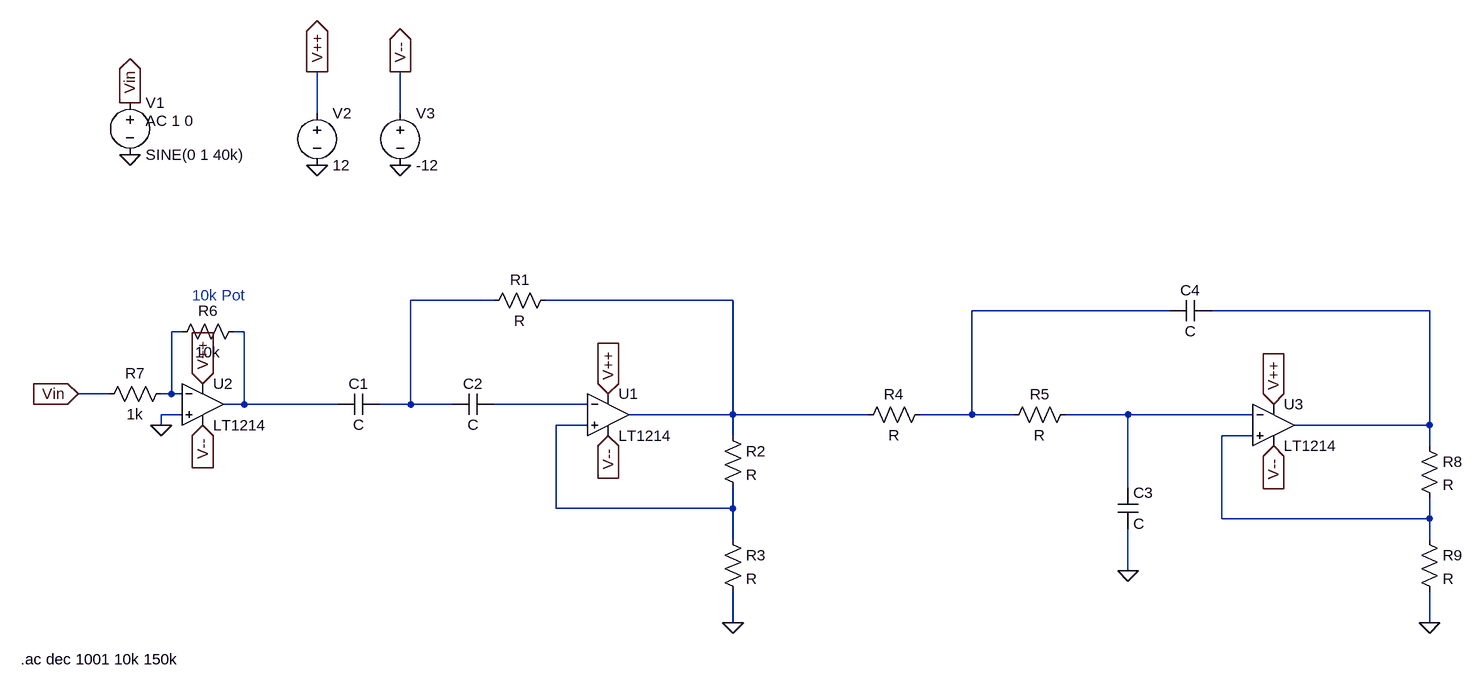
[diagram p0: schematic draftBandpassMultisimLive.asc]
draftBandpassMultisimLive.asc, the LTspice schematic file:
Version 4
SHEET 1 1752 680
WIRE -16 -320 -16 -384
WIRE 112 -320 112 -384
WIRE 256 -32 128 -32
WIRE 624 -32 336 -32
WIRE 1296 -16 992 -16
WIRE 1696 -16 1360 -16
WIRE -224 16 -240 16
WIRE -128 16 -144 16
WIRE -336 112 -384 112
WIRE -240 112 -240 16
WIRE -240 112 -256 112
WIRE -224 112 -240 112
WIRE -128 128 -128 16
WIRE -128 128 -160 128
WIRE 16 128 -128 128
WIRE 128 128 128 -32
WIRE 128 128 80 128
WIRE 192 128 128 128
WIRE 400 128 256 128
WIRE -224 144 -256 144
WIRE 624 144 624 -32
WIRE 624 144 464 144
WIRE 832 144 624 144
WIRE 992 144 992 -16
WIRE 992 144 912 144
WIRE 1056 144 992 144
WIRE 1232 144 1136 144
WIRE 1424 144 1232 144
WIRE -256 160 -256 144
WIRE 400 160 352 160
WIRE 1696 160 1696 -16
WIRE 1696 160 1488 160
WIRE 624 176 624 144
WIRE 1424 176 1376 176
WIRE 1696 192 1696 160
WIRE 1232 256 1232 144
WIRE 352 288 352 160
WIRE 624 288 624 256
WIRE 624 288 352 288
WIRE 1376 304 1376 176
WIRE 1696 304 1696 272
WIRE 1696 304 1376 304
WIRE 624 336 624 288
WIRE 1696 336 1696 304
WIRE 1232 384 1232 320
WIRE 624 464 624 416
WIRE 1696 464 1696 416
FLAG -16 -240 0
FLAG 112 -240 0
FLAG -16 -384 V++
IOPIN -16 -384 Out
FLAG 112 -384 V--
IOPIN 112 -384 Out
FLAG -304 -256 0
FLAG -304 -336 Vin
IOPIN -304 -336 Out
FLAG -256 160 0
FLAG -192 160 V--
IOPIN -192 160 In
FLAG -192 96 V++
IOPIN -192 96 In
FLAG -384 112 Vin
IOPIN -384 112 In
FLAG 432 176 V--
IOPIN 432 176 In
FLAG 432 112 V++
IOPIN 432 112 In
FLAG 624 464 0
FLAG 1232 384 0
FLAG 1456 192 V--
IOPIN 1456 192 In
FLAG 1456 128 V++
IOPIN 1456 128 In
FLAG 1696 464 0
SYMBOL voltage -16 -336 R0
WINDOW 123 0 0 Left 0
WINDOW 39 0 0 Left 0
SYMATTR InstName V2
SYMATTR Value 12
SYMBOL voltage 112 -336 R0
WINDOW 123 0 0 Left 0
WINDOW 39 0 0 Left 0
SYMATTR InstName V3
SYMATTR Value -12
SYMBOL voltage -304 -352 R0
WINDOW 123 24 44 Left 2
WINDOW 39 0 0 Left 0
SYMATTR InstName V1
SYMATTR Value SINE(0 1 40k)
SYMATTR Value2 AC 1 0
SYMBOL Opamps\\LT1214 -192 64 R0
SYMATTR InstName U2
SYMBOL res -128 0 R90
WINDOW 0 0 56 VBottom 2
WINDOW 3 32 56 VTop 2
SYMATTR InstName R6
SYMATTR Value 10k
SYMBOL res -240 96 R90
WINDOW 0 0 56 VBottom 2
WINDOW 3 32 56 VTop 2
SYMATTR InstName R7
SYMATTR Value 1k
SYMBOL cap 80 112 R90
WINDOW 0 0 32 VBottom 2
WINDOW 3 32 32 VTop 2
SYMATTR InstName C1
SYMBOL cap 256 112 R90
WINDOW 0 0 32 VBottom 2
WINDOW 3 32 32 VTop 2
SYMATTR InstName C2
SYMBOL Opamps\\LT1214 432 80 R0
SYMATTR InstName U1
SYMBOL res 352 -48 R90
WINDOW 0 0 56 VBottom 2
WINDOW 3 32 56 VTop 2
SYMATTR InstName R1
SYMBOL res 608 160 R0
SYMATTR InstName R2
SYMBOL res 608 320 R0
SYMATTR InstName R3
SYMBOL res 928 128 R90
WINDOW 0 0 56 VBottom 2
WINDOW 3 32 56 VTop 2
SYMATTR InstName R4
SYMBOL res 1152 128 R90
WINDOW 0 0 56 VBottom 2
WINDOW 3 32 56 VTop 2
SYMATTR InstName R5
SYMBOL cap 1216 256 R0
SYMATTR InstName C3
SYMBOL cap 1360 -32 R90
WINDOW 0 0 32 VBottom 2
WINDOW 3 32 32 VTop 2
SYMATTR InstName C4
SYMBOL Opamps\\LT1214 1456 96 R0
SYMATTR InstName U3
SYMBOL res 1680 176 R0
SYMATTR InstName R8
SYMBOL res 1680 320 R0
SYMATTR InstName R9
TEXT -472 520 Left 2 !.ac dec 1001 10k 150k
TEXT -208 -40 Left 2 ;10k Pot

The netlist it stands for:
* draftBandpassMultisimLive.asc
V2 V++ 0 12
V3 V-- 0 -12
V1 Vin 0 SINE(0 1 40k) AC 1 0
XU2 0 N005 V++ V-- N006 LT1213  ; LT1214, pins In+ In- V+ V- OUT
R6 N006 N005 10k
R7 N005 Vin 1k
C1 N001 N006 C
C2 N007 N001 C
XU1 N009 N007 V++ V-- N002 LT1213  ; LT1214, pins In+ In- V+ V- OUT
R1 N002 N001 R
R2 N002 N009 R
R3 N009 0 R
R4 N003 N002 R
R5 N008 N003 R
C3 N008 0 C
C4 N004 N003 C
XU3 N010 N008 V++ V-- N004 LT1213  ; LT1214, pins In+ In- V+ V- OUT
R8 N004 N010 R
R9 N010 0 R
.ac dec 1001 10k 150k
* 10k Pot
.lib LTC.lib
.backanno
.end